# Altium schematic sheet NixiePSU.SchDoc
size A3
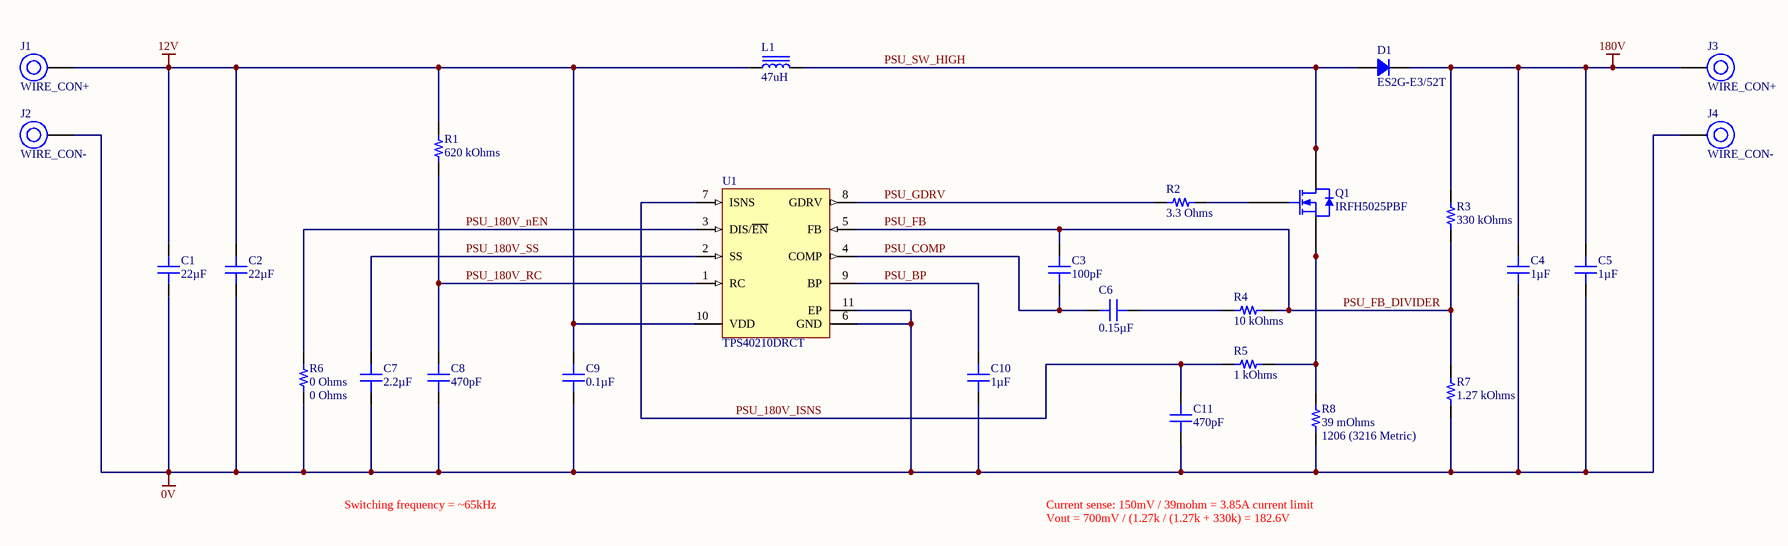
[diagram p0: NixiePSU.SchDoc]

## Parts
C1  22µF  [CAP 1210_3225 - 2.8MM]
C2  22µF  [CAP 1210_3225 - 2.8MM]
C3  100pF  [CAP 0603_1608]
C4  1µF  [CAP 2220_5650 2.0MM]
C5  1µF  [CAP 2220_5650 2.0MM]
C6  0.15µF  [CAP 0603_1608]
C7  2.2µF  [CAP 0603_1608]
C8  470pF  [CAP 0603_1608]
C9  0.1µF  [CAP 0603_1608]
C10  1µF  [CAP 0603_1608]
C11  470pF  [CAP 0603_1608]
D1  ES2G-E3/52T  [DO214AA SMB]
J1  WIRE_CON+  [WIRE_PAD+]
J2  WIRE_CON-  [WIRE_PAD-]
J3  WIRE_CON+  [WIRE_PAD+]
J4  WIRE_CON-  [WIRE_PAD-]
L1  47uH  [SRP1040VA]
Q1  IRFH5025PBF  [QFN127P600X500X80_HS-9M]
R1  620 kOhms  [RES 0603_1608]
R2  3.3 Ohms  [RES 0603_1608]
R3  330 kOhms  [RES 0603_1608]
R4  10 kOhms  [RES 0603_1608]
R5  1 kOhms  [RES 0603_1608]
R6  0 Ohms  [RES 0603_1608]
R7  1.27 kOhms  [RES 0603_1608]
R8  39 mOhms  Package / Case: 1206 (3216 Metric)  [STACKPOLE CSR1206]
U1  TPS40210DRCT  [DRC0010A_V]

## Nets
0V: C1.1 C2.1 C4.1 C5.1 C7.1 C8.1 C9.1 C10.1 C11.1 J2.1 J4.1 R6.1 R7.1 R8.1 U1.6(GND) U1.11(EP)
12V: C1.2 C2.2 C9.2 J1.1 L1.1 R1.2 U1.10(VDD)
180V: C4.2 C5.2 D1.2 J3.1 R3.2
PSU_180V_ISNS: C11.2 R5.1 U1.7(ISNS)
PSU_180V_nEN: R6.2 U1.3(DIS/~{EN})
PSU_180V_RC: C8.2 R1.1 U1.1(RC)
PSU_180V_SS: C7.2 U1.2(SS)
PSU_BP: C10.2 U1.9(BP)
PSU_COMP: C3.2 C6.1 U1.4(COMP)
PSU_FB: C3.1 R3.1 R4.2 R7.2 U1.5(FB)  [also labelled PSU_FB_DIVIDER]
PSU_GDRV: R2.1 U1.8(GDRV)
PSU_SW_HIGH: D1.1 L1.2 Q1.5(D) Q1.6(D) Q1.7(D) Q1.8(D) Q1.9(D)
NetC6_2: C6.2 R4.1
NetQ1_1: Q1.1(S) Q1.2(S) Q1.3(S) R5.2 R8.2
NetQ1_4: Q1.4(G) R2.2

## Notes on the sheet
- Switching frequency = ~65kHz
- Current sense: 150mV / 39mohm = 3.85A current limit
- Vout = 700mV / (1.27k / (1.27k + 330k) = 182.6V

## Library data of the parts
C1 C2 = GRM32EC81E226KE15L: CAP CER 22UF 25V X6S 1210; Part Number: GRM32EC81E226KE15L; Value: 22µF
C3 = C0603C101K4GAC7867: CAP CER 100PF 16V NP0 0603; Manufacturer: KEMET; Temperature Coefficient: C0G, NP0; Tolerance: ±10%; Part Number: C0603C101K4GAC7867; Value: 100pF; Applications: General Purpose; Capacitance: 100pF; ComponentLink1Description: Datasheet; ComponentLink1URL: https://api.kemet.com/component-edge/download/datasheet/C0603C101K4GACTU.pdf; ComponentLink2Description: DigiKey Link; ComponentLink2URL: http://digikey.com/product-detail/en/kemet/C0603C101K4GAC7867/399-17390-1-ND/8570357; Device Package: 0603 (1608 Metric); Features: Low ESL; LastUpdated: 21/01/2020 12:01:41 AM; Lifecycle Status: Active; Minimum Order: 1; Mounting Type: Surface Mount, MLCC; Operating Temperature: -55°C ~ 125°C; Package / Case: 0603 (1608 Metric); Packaging: TapeAndReel; PartId: 16900; Part Status: Active; Price: 0.05; Series: SMD Comm C0G; Size / Dimension: 0.063" L x 0.031" W (1.60mm x 0.80mm); Supplier 1: DigiKey; Supplier Part Number 1: 399-17390-1-ND; Thickness (Max): 0.034" (0.87mm); Voltage - Rated: 16V
C4 C5 = C2220C105KARACTU: CAP CER 1UF 250V X7R 2220; Manufacturer: KEMET; Tolerance: ±10%; Part Number: C2220C105KARACTU; Value: 1µF; Applications: General Purpose; Capacitance: 1µF; ComponentLink1Description: Datasheet; ComponentLink1URL: https://api.kemet.com/component-edge/download/datasheet/C2220C105KARACTU.pdf; ComponentLink2Description: DigiKey Link; ComponentLink2URL: http://digikey.com/product-detail/en/kemet/C2220C105KARACTU/399-4690-1-ND/992215; Device Package: 2220 (5750 Metric); LastUpdated: 21/01/2020 12:34:33 AM; Lifecycle Status: Active; Minimum Order: 1; Mounting Type: Surface Mount, MLCC; Operating Temperature: -55°C ~ 125°C; Package / Case: 2220 (5750 Metric); Packaging: TapeAndReel; Part Status: Active; Price: 0.87; Series: SMD Comm X7R Tip-Ring; Size / Dimension: 0.224" L x 0.197" W (5.70mm x 5.00mm); Supplier 1: DigiKey; Supplier Part Number 1: 399-4690-1-ND; Temperature Coefficient: X7R; Thickness (Max): 0.065" (1.65mm); Voltage - Rated: 250V
C6 = CC0603KRX7R7BB154: CAP CER 0.15UF 16V X7R 0603; Manufacturer: Yageo; Tolerance: ±10%; Part Number: CC0603KRX7R7BB154; Value: 0.15µF; Applications: General Purpose; Capacitance: 0.15µF; ComponentLink1Description: Datasheet; ComponentLink1URL: https://www.yageo.com/upload/media/product/productsearch/datasheet/mlcc/UPY-GPHC_X7R_6.3V-to-50V_18.pdf; ComponentLink2Description: DigiKey Link; ComponentLink2URL: http://digikey.com/product-detail/en/yageo/CC0603KRX7R7BB154/311-1799-1-ND/5195701; Device Package: 0603 (1608 Metric); LastUpdated: 21/01/2020 12:02:09 AM; Lifecycle Status: Active; Minimum Order: 1; Mounting Type: Surface Mount, MLCC; Operating Temperature: -55°C ~ 125°C; Package / Case: 0603 (1608 Metric); Packaging: TapeAndReel; PartId: 2211; Part Status: Active; Price: 0.02; Series: CC; Size / Dimension: 0.063" L x 0.031" W (1.60mm x 0.80mm); Supplier 1: DigiKey; Supplier Part Number 1: 311-1799-1-ND; Temperature Coefficient: X7R; Thickness (Max): 0.035" (0.90mm); Voltage - Rated: 16V
C7 = GRM188R61H225KE11D: CAP CER 2.2UF 50V X5R 0603; Part Number: GRM188R61H225KE11D; Value: 2.2µF
C8 C11 = CGJ3E2C0G1H471J080AA: CAP CER 470PF 50V C0G 0603; Part Number: CGJ3E2C0G1H471J080AA; Value: 470pF
C9 = C0603C104K3PAC7867: CAP CER 0.1UF 25V X5R 0603; Manufacturer: KEMET; Tolerance: ±10%; Part Number: C0603C104K3PAC7867; Value: 0.1µF; Applications: General Purpose; Capacitance: 0.1µF; ComponentLink1Description: Datasheet; ComponentLink1URL: https://api.kemet.com/component-edge/download/datasheet/C0603C104K3PAC7867.pdf; ComponentLink2Description: DigiKey Link; ComponentLink2URL: http://digikey.com/product-detail/en/kemet/C0603C104K3PAC7867/399-14940-1-ND/7382489; Device Package: 0603 (1608 Metric); LastUpdated: 21/01/2020 12:01:53 AM; Lifecycle Status: Active; Minimum Order: 1; Mounting Type: Surface Mount, MLCC; Operating Temperature: -55°C ~ 85°C; Package / Case: 0603 (1608 Metric); Packaging: TapeAndReel; PartId: 12657; Part Status: Active; Price: 0.07; Series: SMD Comm X5R; Size / Dimension: 0.063" L x 0.031" W (1.60mm x 0.80mm); Supplier 1: DigiKey; Supplier Part Number 1: 399-14940-1-ND; Temperature Coefficient: X5R; Thickness (Max): 0.035" (0.90mm); Voltage - Rated: 25V
C10 = CGJ3E1X7R1E105K080AC: CAP CER 1UF 25V X7R 0603; Manufacturer: TDK Corporation; Tolerance: ±10%; Part Number: CGJ3E1X7R1E105K080AC; Value: 1µF; Applications: Automotive; Capacitance: 1µF; ComponentLink1Description: Datasheet; ComponentLink1URL: https://product.tdk.com/info/en/catalog/datasheets/mlcc_highreliability_general_en.pdf?ref_disty=digikey; ComponentLink2Description: DigiKey Link; ComponentLink2URL: http://digikey.com/product-detail/en/tdk-corporation/CGJ3E1X7R1E105K080AC/445-13311-1-ND/3954977; Device Package: 0603 (1608 Metric); LastUpdated: 21/01/2020 12:02:09 AM; Lifecycle Status: Active; Minimum Order: 1; Mounting Type: Surface Mount, MLCC; Operating Temperature: -55°C ~ 125°C; Package / Case: 0603 (1608 Metric); Packaging: TapeAndReel; PartId: 2643; Part Status: Active; Price: 0.10; Ratings: AEC-Q200; Series: CGJ; Size / Dimension: 0.063" L x 0.031" W (1.60mm x 0.80mm); Supplier 1: DigiKey; Supplier Part Number 1: 445-13311-1-ND; Temperature Coefficient: X7R; Thickness (Max): 0.031" (0.80mm); Voltage - Rated: 25V
D1 = ES2G-E3/52T: DIODE GEN PURP 400V 2A DO214AA; Manufacturer: Vishay Semiconductor Diodes Division; Capacitance @ Vr, F: 15pF @ 4V, 1MHz; Current - Reverse Leakage @ Vr: 10µA @ 400V; Diode Type: Standard; Reverse Recovery Time (trr): 50ns; Speed: Fast Recovery =< 500ns, > 200mA (Io); Voltage - Forward (Vf) (Max) @ If: 1.1V @ 2A; Part Number: ES2G-E3/52T; ComponentLink1Description: Datasheet; ComponentLink1URL: http://www.vishay.com/docs/88588/es2f.pdf; ComponentLink2Description: DigiKey Link; ComponentLink2URL: http://digikey.com/product-detail/en/vishay-semiconductor-diodes-division/ES2G-E3-52T/ES2G-E3-52TGICT-ND/1091576; Current - Average Rectified (Io): 2A; Device Package: DO-214AA, SMB; LastUpdated: 21/01/2020 2:37:13 AM; Lifecycle Status: Active; Minimum Order: 1; Mounting Type: Surface Mount; Operating Temperature - Junction: -55°C ~ 150°C; Package / Case: DO-214AA, SMB; Packaging: TapeAndReel; PartId: 235; Part Status: Active; Price: 0.20; Series: -; Supplier 1: DigiKey; Supplier Part Number 1: ES2G-E3/52TGICT-ND; Supplier Device Package: DO-214AA (SMB); Voltage - DC Reverse (Vr) (Max): 400V
J1 J3 = WIRE_CON+: Wire pad connection
J2 J4 = WIRE_CON-: Wire pad connection
L1 = SRP1040VA-470M: FIXED IND 47UH 4A 167MOHM SMD; Current - Saturation: 4.5A; ComponentLink1Description: Datasheet; ComponentLink1URL: https://www.bourns.com/docs/product-datasheets/srp1040va.pdf?sfvrsn=d53f46f6_2; Value: 47uH; Current Rating (Amps): 4A; DC Resistance (DCR): 167mOhm; Height - Seated (Max): 4mm; Supplier 1: DigiKey; Supplier Part Number 1: 118-SRP1040VA-470MCT-ND
Q1 = IRFH5025PBF N Channel FET: IRFH5025TRPBF -  MOSFET Transistor, N Channel, 25 A, 250 V, 0.084 ohm, 10 V, 5 V
R1 = ERJ-3EKF6203V: RES SMD 620K OHM 1% 1/10W 0603; Part Number: ERJ-3EKF6203V; Value: 620 kOhms
R2 = ERJ-3RQF3R3V: RES SMD 3.3 OHM 1% 1/10W 0603; Manufacturer: Panasonic Electronic Components; Power (Watts): 0.1W, 1/10W; Temperature Coefficient: ±200ppm/°C; Part Number: ERJ-3RQF3R3V; Value: 3.3 Ohms; ComponentLink1Description: Datasheet; ComponentLink1URL: https://industrial.panasonic.com/cdbs/www-data/pdf/RDN0000/AOA0000C313.pdf; ComponentLink2Description: DigiKey Link; ComponentLink2URL: http://digikey.com/product-detail/en/panasonic-electronic-components/ERJ-3RQF3R3V/P3.3AJCT-ND/308116; Composition: Thick Film; Device Package: 0603 (1608 Metric); Features: Automotive AEC-Q200, Current Sense; Height - Seated (Max): 0.022" (0.55mm); LastUpdated: 21/01/2020 12:21:04 AM; Lifecycle Status: Active; Minimum Order: 1; Number of Terminations: 2; Operating Temperature: -55°C ~ 125°C; Package / Case: 0603 (1608 Metric); Packaging: TapeAndReel; PartId: 14563; Part Status: Active; Price: 0.02; Ratings: AEC-Q200; Resistance: 3.3 Ohms; Series: ERJ; Size / Dimension: 0.063" L x 0.031" W (1.60mm x 0.80mm); Supplier 1: DigiKey; Supplier Part Number 1: P3.3AJCT-ND; Supplier Device Package: 0603; Tolerance: ±1%
R3 = ERJ-3EKF3303V: RES SMD 330K OHM 1% 1/10W 0603; Manufacturer: Panasonic Electronic Components; Power (Watts): 0.1W, 1/10W; Temperature Coefficient: ±100ppm/°C; Part Number: ERJ-3EKF3303V; Value: 330 kOhms; ComponentLink1Description: Datasheet; ComponentLink1URL: https://industrial.panasonic.com/cdbs/www-data/pdf/RDA0000/AOA0000C304.pdf; ComponentLink2Description: DigiKey Link; ComponentLink2URL: http://digikey.com/product-detail/en/panasonic-electronic-components/ERJ-3EKF3303V/P330KHCT-ND/1746764; Composition: Thick Film; Device Package: 0603 (1608 Metric); Features: Automotive AEC-Q200; Height - Seated (Max): 0.022" (0.55mm); LastUpdated: 21/01/2020 12:17:17 AM; Lifecycle Status: Active; Minimum Order: 1; Number of Terminations: 2; Operating Temperature: -55°C ~ 155°C; Package / Case: 0603 (1608 Metric); Packaging: TapeAndReel; PartId: 23057; Part Status: Active; Price: 0.01; Ratings: AEC-Q200; Resistance: 330 kOhms; Series: ERJ; Size / Dimension: 0.063" L x 0.031" W (1.60mm x 0.80mm); Supplier 1: DigiKey; Supplier Part Number 1: P330KHCT-ND; Supplier Device Package: 0603; Tolerance: ±1%
R4 = ERJ-3EKF1002V: RES SMD 10K OHM 1% 1/10W 0603; Manufacturer: Panasonic Electronic Components; Power (Watts): 0.1W, 1/10W; Temperature Coefficient: ±100ppm/°C; Part Number: ERJ-3EKF1002V; Value: 10 kOhms; ComponentLink1Description: Datasheet; ComponentLink1URL: https://industrial.panasonic.com/cdbs/www-data/pdf/RDA0000/AOA0000C304.pdf; ComponentLink2Description: DigiKey Link; ComponentLink2URL: http://digikey.com/product-detail/en/panasonic-electronic-components/ERJ-3EKF1002V/P10.0KHCT-ND/198102; Composition: Thick Film; Device Package: 0603 (1608 Metric); Features: Automotive AEC-Q200; Height - Seated (Max): 0.022" (0.55mm); LastUpdated: 21/01/2020 12:14:57 AM; Lifecycle Status: Active; Minimum Order: 1; Number of Terminations: 2; Operating Temperature: -55°C ~ 155°C; Package / Case: 0603 (1608 Metric); Packaging: TapeAndReel; PartId: 25695; Part Status: Active; Price: 0.01; Ratings: AEC-Q200; Resistance: 10 kOhms; Series: ERJ; Size / Dimension: 0.063" L x 0.031" W (1.60mm x 0.80mm); Supplier 1: DigiKey; Supplier Part Number 1: P10.0KHCT-ND; Supplier Device Package: 0603; Tolerance: ±1%
R5 = ERJ-3EKF1001V: RES SMD 1K OHM 1% 1/10W 0603; Manufacturer: Panasonic Electronic Components; Power (Watts): 0.1W, 1/10W; Temperature Coefficient: ±100ppm/°C; Part Number: ERJ-3EKF1001V; Value: 1 kOhms; ComponentLink1Description: Datasheet; ComponentLink1URL: https://industrial.panasonic.com/cdbs/www-data/pdf/RDA0000/AOA0000C304.pdf; ComponentLink2Description: DigiKey Link; ComponentLink2URL: http://digikey.com/product-detail/en/panasonic-electronic-components/ERJ-3EKF1001V/P1.00KHCT-ND/198071; Composition: Thick Film; Device Package: 0603 (1608 Metric); Features: Automotive AEC-Q200; Height - Seated (Max): 0.022" (0.55mm); LastUpdated: 21/01/2020 12:14:57 AM; Lifecycle Status: Active; Minimum Order: 1; Number of Terminations: 2; Operating Temperature: -55°C ~ 155°C; Package / Case: 0603 (1608 Metric); Packaging: TapeAndReel; PartId: 25687; Part Status: Active; Price: 0.01; Ratings: AEC-Q200; Resistance: 1 kOhms; Series: ERJ; Size / Dimension: 0.063" L x 0.031" W (1.60mm x 0.80mm); Supplier 1: DigiKey; Supplier Part Number 1: P1.00KHCT-ND; Supplier Device Package: 0603; Tolerance: ±1%
R6 = CR0603-J/-000EAS: RES 0 OHM JUMPER 0.01W 0603; Part Number: CR0603-J/-000EAS; Value: 0 Ohms
R7 = ERJ-3EKF1271V: RES SMD 1.27K OHM 1% 1/10W 0603; Manufacturer: Panasonic Electronic Components; Power (Watts): 0.1W, 1/10W; Temperature Coefficient: ±100ppm/°C; Part Number: ERJ-3EKF1271V; Value: 1.27 kOhms; ComponentLink1Description: Datasheet; ComponentLink1URL: https://industrial.panasonic.com/cdbs/www-data/pdf/RDA0000/AOA0000C304.pdf; ComponentLink2Description: DigiKey Link; ComponentLink2URL: http://digikey.com/product-detail/en/panasonic-electronic-components/ERJ-3EKF1271V/P1.27KHCT-ND/198081; Composition: Thick Film; Device Package: 0603 (1608 Metric); Features: Automotive AEC-Q200; Height - Seated (Max): 0.022" (0.55mm); LastUpdated: 21/01/2020 12:16:20 AM; Lifecycle Status: Active; Minimum Order: 1; Number of Terminations: 2; Operating Temperature: -55°C ~ 155°C; Package / Case: 0603 (1608 Metric); Packaging: TapeAndReel; PartId: 24158; Part Status: Active; Price: 0.01; Ratings: AEC-Q200; Resistance: 1.27 kOhms; Series: ERJ; Size / Dimension: 0.063" L x 0.031" W (1.60mm x 0.80mm); Supplier 1: DigiKey; Supplier Part Number 1: P1.27KHCT-ND; Supplier Device Package: 0603; Tolerance: ±1%
R8 = ERJ-8BWFR039V: RES 0.039 OHM 1% 1W 1206; Manufacturer: Panasonic Electronic Components; Temperature Coefficient: ±150ppm/°C; Part Number: ERJ-8BWFR039V; ComponentLink1Description: Datasheet; ComponentLink1URL: https://industrial.panasonic.com/cdbs/www-data/pdf/RDN0000/AOA0000C313.pdf; ComponentLink2Description: DigiKey Link; ComponentLink2URL: http://digikey.com/product-detail/en/panasonic-electronic-components/ERJ-8BWFR039V/P.039AUCT-ND/1711696; Composition: Thick Film; Device Package: 1206 (3216 Metric); Features: Automotive AEC-Q200, Current Sense; Height - Seated (Max): 0.030" (0.75mm); LastUpdated: 21/01/2020 2:21:17 AM; Lifecycle Status: Active; Minimum Order: 1; Number of Terminations: 2; Operating Temperature: -55°C ~ 155°C; Packaging: TapeAndReel; PartId: 2160; Part Status: Active; Power (Watts): 1W; Price: 0.21; Ratings: AEC-Q200; Resistance: 39 mOhms; Series: ERJ; Size / Dimension: 0.126" L x 0.063" W (3.20mm x 1.60mm); Supplier 1: DigiKey; Supplier Part Number 1: P.039AUCT-ND; Supplier Device Package: 1206; Tolerance: ±1%; Value: 39 mOhms
U1 = CMP-0342-00149-2: Wide Input Range Current Mode Boost Controller, 95 % Duty Cycle, 4.5 to 52 V, -40 to 125 degC, 10-pin SON (DRC), Green (RoHS & no Sb/Br); Manufacturer: Texas Instruments; Regulated Outputs(#): 1; Vin(Min)(V): 4.5; Switching Frequency(Max)(kHz): 1000; Iout(Max)(A): 6; Vout(Min)(V): 5; SubFamily: Step-Up Controller; Vin(Max)(V): 52; Duty Cycle(Max)(%): 95; Vout(Max)(V): 260; PartNumber: TPS40210DRCT; Eco-Plan: Green (RoHS & no Sb/Br); Mounting Technology: Surface Mount; ComponentLink1URL: http://www.ti.com/general/docs/lit/getliterature.tsp?genericPartNumber=TPS40210&fileType=pdf; PackageDescription: 10-Pin Plastic Small Outline No-Lead, 3 x 3 x 1 mm Body, 0.5 mm Pitch, Exposed Pad; DatasheetVersion: SLUS772E; ComponentLink1Description: Datasheet; ComponentLink2URL: http://www.ti.com/litv/pdf/mpds117k; ComponentLink2Description: Package Specification; Topology: Boost; PackageVersion: revL, Sep-2011; PackageReference: DRC0010A